# EAGLE design Button (EAGLE 9.6.2)
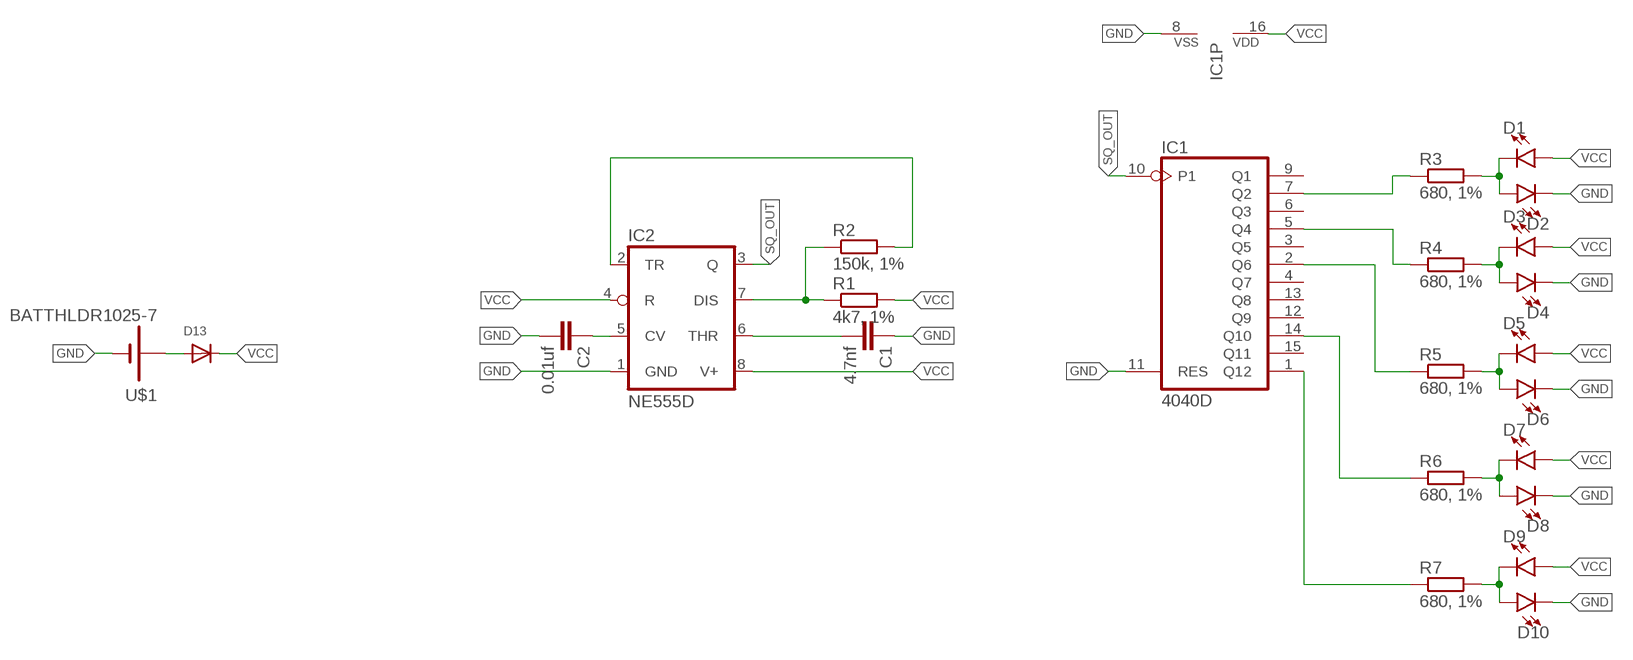
[diagram p0: schematic, sheet 1]

## Parts
C1  4.7nf  C-EUC1206  [C1206]
C2  0.01uf  C-EUC1206  [C1206]
D1  LED1206  [LED-1206]
D2  LED1206  [LED-1206]
D3  LED1206  [LED-1206]
D4  LED1206  [LED-1206]
D5  LED1206  [LED-1206]
D6  LED1206  [LED-1206]
D7  LED1206  [LED-1206]
D8  LED1206  [LED-1206]
D9  LED1206  [LED-1206]
D10  LED1206  [LED-1206]
D13  DIODESMA  [SMADIODE]
IC1  4040D  [SO16]
IC2  NE555D  [SO08]
R1  4k7, 1%  R-EU_R1206  [R1206]
R2  150k, 1%  R-EU_R1206  [R1206]
R3  680, 1%  R-EU_R1206  [R1206]
R4  680, 1%  R-EU_R1206  [R1206]
R5  680, 1%  R-EU_R1206  [R1206]
R6  680, 1%  R-EU_R1206  [R1206]
R7  680, 1%  R-EU_R1206  [R1206]
U$1  BATTHLDR1025-7  [BATTHLDR1025-7]

## Nets
+VBAT: D13.A U$1.POSITIVE(+)
GND: C1.1 C2.2 D2.C D4.C D6.C D8.C D10.C IC1.8(VSS) IC1.11(RES) IC2.1(GND) U$1.NEGATIVE(-)
N$1: C1.2 IC2.6(THR)
N$2: IC2.7(DIS) R1.1 R2.1
N$3: IC2.2(TR) R2.2
N$4: C2.1 IC2.5(CV)
N$5: D1.C D2.A R3.2
N$6: IC1.7(Q2) R3.1
N$7: D3.C D4.A R4.2
N$8: IC1.5(Q4) R4.1
N$9: D5.C D6.A R5.2
N$10: IC1.2(Q6) R5.1
N$11: D7.C D8.A R6.2
N$12: IC1.14(Q10) R6.1
N$13: D9.C D10.A R7.2
N$14: IC1.1(Q12) R7.1
SQ_OUT: IC1.10(P1) IC2.3(Q)
VCC: D1.A D3.A D5.A D7.A D9.A D13.C IC1.16(VDD) IC2.4(R) IC2.8(V+) R1.2
Unconnected: IC1.3(Q5) IC1.4(Q7) IC1.6(Q3) IC1.9(Q1) IC1.12(Q9) IC1.13(Q8) IC1.15(Q11)

## Library data of the parts
C1 C2 = rcl:C-EU: CAPACITOR, European symbol; SPICEPREFIX: C
D1-D10 = SparkFun-LED:LED: LED (Generic) Standard schematic elements and footprints for 5mm, 3mm, 1206, and 0603 sized LEDs. Generic LEDs with no color specified.
D13 = adafruit:DIODE: Diode SMADIODE - SMA Surface Mount Package 20V 1A Schottky Diode Digikey: 641-1014-6-ND DO-1N4148 - Through Hole Small Current Diode SOD-123 20V 1 A (.5mV Vf) Schottky Diode - Digikey: MBRX120TPMSCT-ND SOD-323 10V 570mA (.38mV Vf, 3ns) Schottky Diode - Digikey: ZLLS410CT-ND SOD-523 30V 30mA Schottky Diode (RB751S-40TE61) - Digikey: RB751S-40TE61CT-ND SOT23-R/W - SOT23 Package (R = Solder Paste/Reflow Ovens, W = Hand-Soldering) BAT54Film 40V 300mA - Digikey: 497-7162-1-ND
IC1 = 40xx:4040: 12-stage binary/ripple COUNTER
IC2 = linear:*555: TIMER
R1-R7 = rcl:R-EU_: RESISTOR, European symbol; SPICEPREFIX: R
U$1 = BATT_HLDR_COIN:BATTHLDR1025-7

## Net classes
0 default: width 0.305 mm, drill 0.305 mm, clearance 0.305 mm

## Board
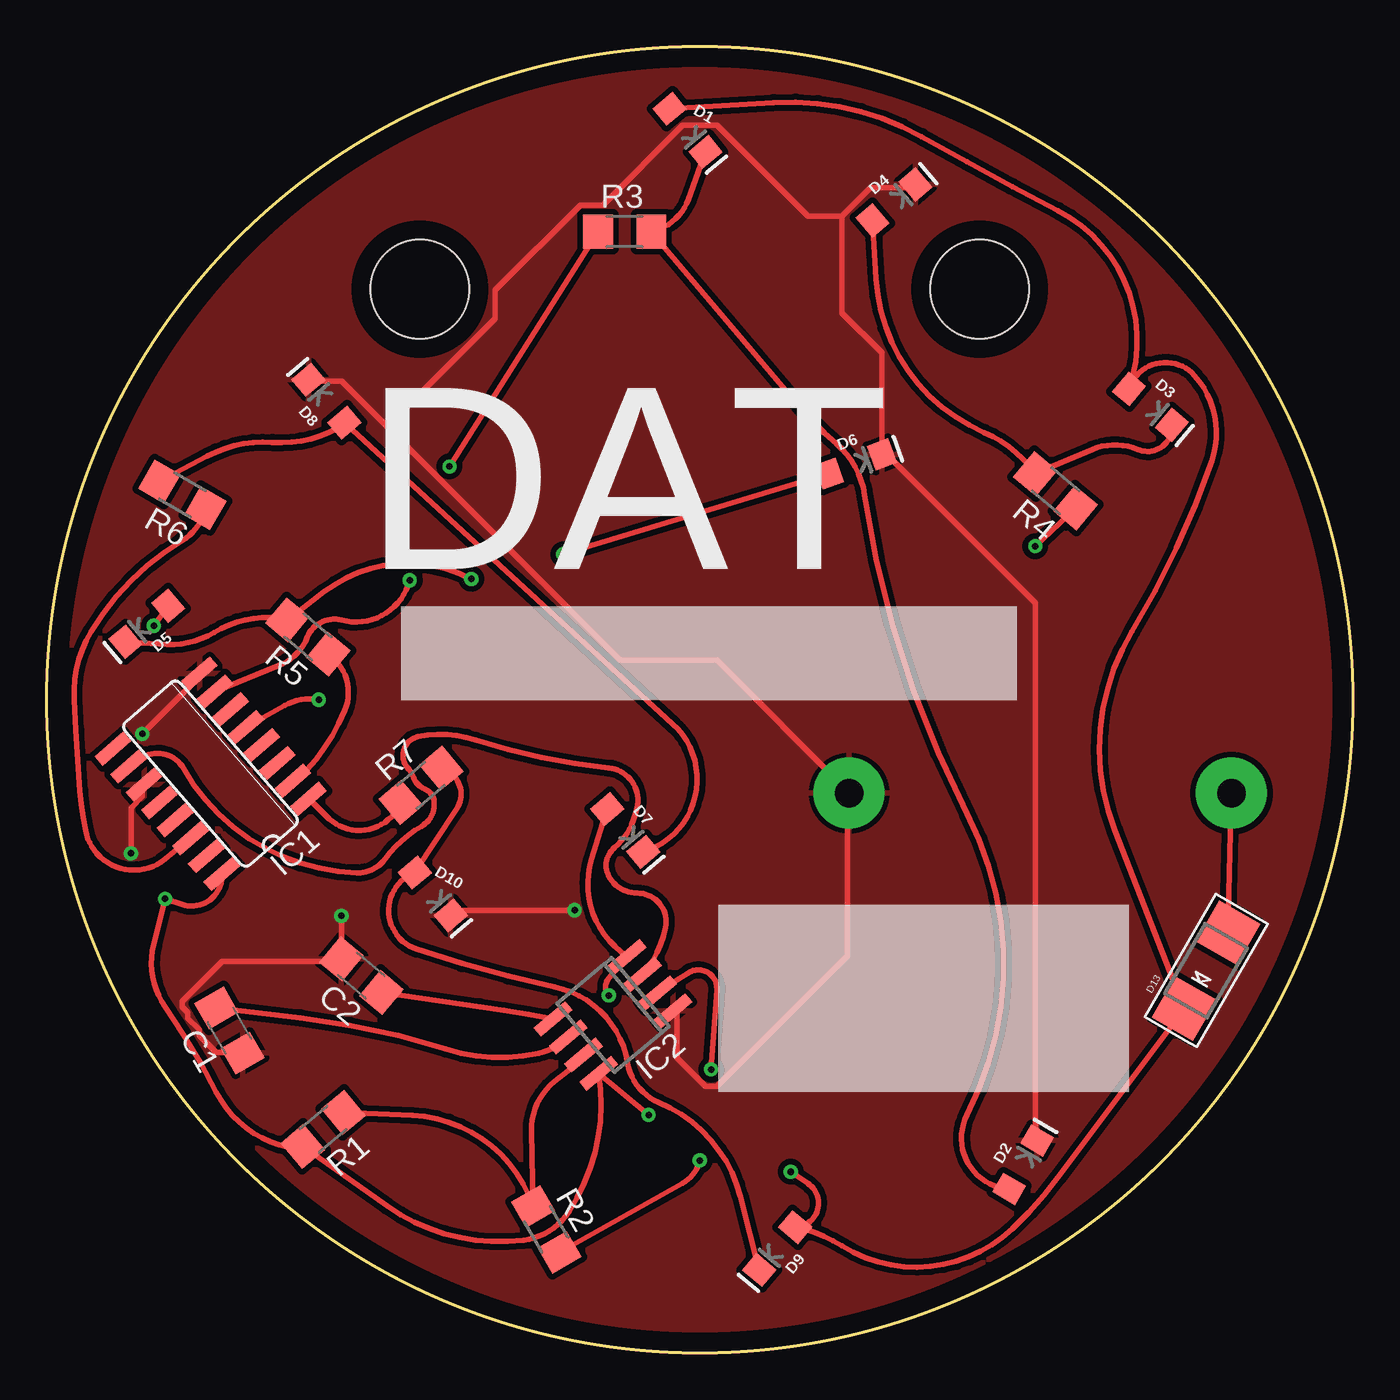
[diagram p1: board, top side]
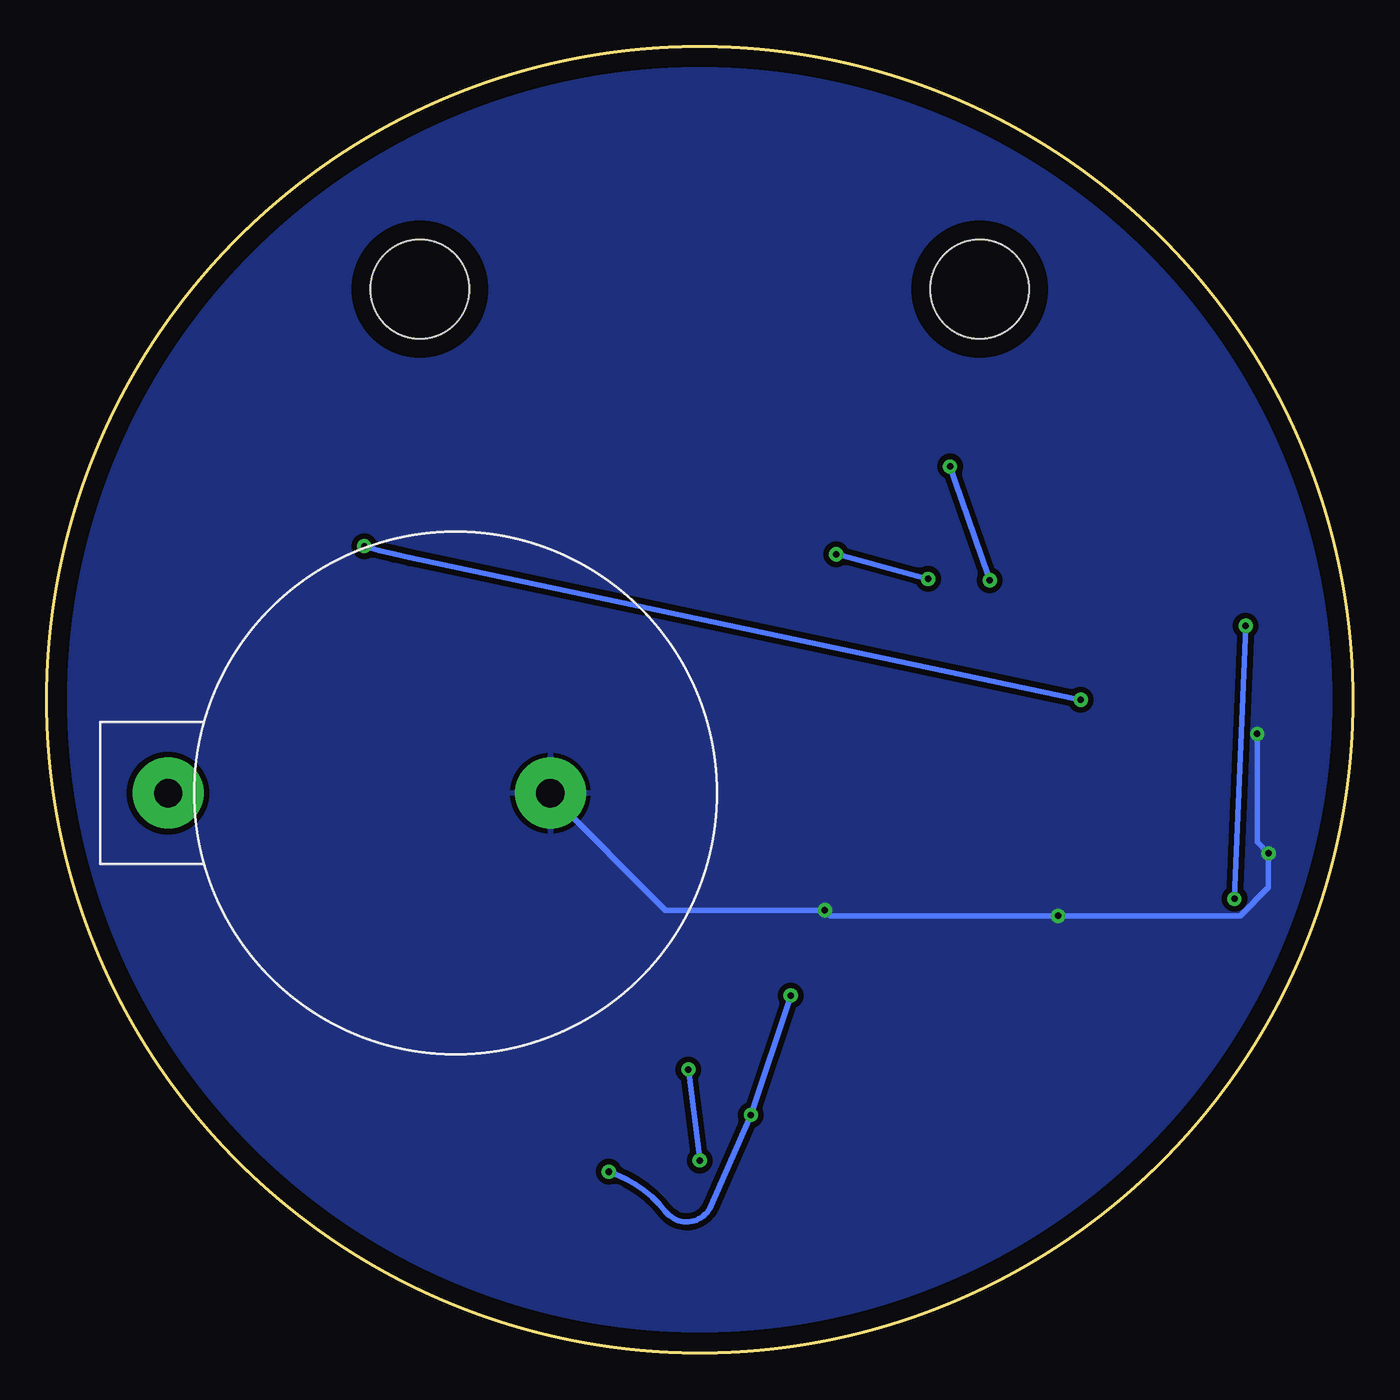
[diagram p2: board, bottom side, seen from below]

Size 70 x 70 mm. Coordinates in mm from the lower left corner, seen from the top.
Outline: circle at 35,35 radius 35
Copper layers (1*16): Top 0.035mm / dielectric 1.5mm / Bottom 0.035mm
Design rules "default": minimum track width 6mil, minimum drill 0.35mm, track to track 6mil, track to pad 6mil, pad to pad 6mil, via to via 6mil, smd to smd 6mil, copper to edge 40mil, drill to drill 6mil, minimum pad ring 10mil, minimum via ring 8mil, stop-mask expansion 4mil, vias tented up to drill 0mil, thermal gap 10mil
Holes 5.3 mm at 50,57 20,57

### Footprints (pad centres in the part's own frame; a part is rotated, then mirrored left to right if it is on the bottom)
C1206 = smd 1.6 x 1.8: 1 -1.4,0; 2 1.4,0
LED-1206 = smd 1.2 x 1.4: A -1.5,0; C 1.5,0
SMADIODE = smd 2.54 x 2.54: A 2.349,0; C -2.349,0
SO16 = smd 0.66 x 2.032: 1 -4.445,-3.073; 2 -3.175,-3.073; 3 -1.905,-3.073; 4 -0.635,-3.073; 5 0.635,-3.073; 6 1.905,-3.073; 7 3.175,-3.073; 8 4.445,-3.073; 9 4.445,3.073; 10 3.175,3.073; 11 1.905,3.073; 12 0.635,3.073; 13 -0.635,3.073; 14 -1.905,3.073; 15 -3.175,3.073; 16 -4.445,3.073
SO08 = smd 0.6 x 2.2: 1 -1.905,-2.6; 2 -0.635,-2.6; 3 0.635,-2.6; 4 1.905,-2.6; 5 1.905,2.6; 6 0.635,2.6; 7 -0.635,2.6; 8 -1.905,2.6
R1206 = smd 1.6 x 1.803: 1 -1.422,0; 2 1.422,0
BATTHLDR1025-7 = drill 1.52 pad 3.81: NEGATIVE 0,0; POSITIVE 20.49,0

### Placement (x,y rotation side)
C1  9.8,17.28 120 top
C2  16.86,20.21 140 top
D1  34.34,65.51 310 top
D2  52.33,10.09 60 top
D3  59.15,50.7 320 top
D4  45.41,61.66 40 top
D5  5.36,39.06 220 top
D6  43.35,47.64 20 top
D7  31,28 310 top
D8  15,51 130 top
D9  39.15,5.59 230 top
D10  20.69,24.59 310 top
D13  62.14,20.48 60 top
IC1  8.79,31.04 131 top
IC2  30.35,18.12 130 top
R1  14.81,11.97 220 top
R2  26.77,6.61 300 top
R3  30.98,60.09 0 top
R4  54.06,46.2 140 top
R5  14,38.37 140 top
R6  7.27,45.99 150 top
R7  20.06,30.42 40 top
U$1  43,30 180 bottom

### Tracks (layer width: path | path; a pad name or v marks a point on that pad's centre or on a via)
+VBAT
  Top 0.305: D13.A U$1.POSITIVE
GND  (via drill 0.35)
  Top 0.305: 42.62,60.91 42.62,55.73 44.75,53.59 44.75,48.41 D6.C 45.06,48.11 52.98,40.18 52.98,11.53 D2.C | 42.62,60.91 44.14,62.43 46.28,62.43 D4.C | C1.1 10.31,16.1 9.09,16.1 8.18,17.02 8.18,17.32 7.57,17.93 7.57,18.24 7.26,18.54 7.26,18.85 9.4,20.98 15.49,20.98 C2.2 15.8,21.28 v15.8,23.42 | 18.24,49.63 30.73,37.13 35.91,37.13 42.92,30.12 U$1.NEGATIVE 42.92,29.82 42.92,21.28 35.91,14.27 35.3,14.27 33.78,15.8 33.78,18.24 IC2.1 | 18.24,49.63 15.8,52.07 14.27,52.07 D8.C | v28.29,23.72 21.89,23.72 D10.C | v4.52,26.77 4.52,29.21 5.13,29.82 5.13,30.43 IC1.11 | v5.13,33.17 8.18,36.22 IC1.8 | 42.62,60.91 40.79,60.91 35.91,65.78 34.09,65.78 29.82,61.52 28.6,61.52 24.03,56.95 24.03,55.42 18.24,49.63
  Bottom 0.305: U$1.NEGATIVE 42.92,29.82 36.83,23.72 v28.29,23.72 27.99,23.42 v15.8,23.42 6.04,23.42 4.52,24.94 v4.52,26.77 5.13,27.38 v5.13,33.17
  pour Top: -19.86,79.5 77.98,79.5 77.98,-15.9 -19.86,-15.9
  pour Bottom: -26.57,85.9 83.16,85.9 83.16,-26.57 -26.57,-26.57
N$1
  Top 0.305: C1.2 13.59,17.96 arc-11 21.39,16.28 arc30 26.36,16.05 arc33 IC2.6
N$2
  Top 0.305: R1.1 19.61,12.72 arc-69 R2.1 25.98,11.89 arc-57 27.46,14.73 arc18 IC2.7
N$3  (via drill 0.35)
  Top 0.305: R2.2 34.09,9.09 arc48 v35,10.31 | v35.61,15.19 35.91,19.45 arc126 34.39,20.37 arc2 IC2.2
  Bottom 0.305: v35,10.31 v35.61,15.19
N$4
  Top 0.305: C2.1 23.21,18.54 arc-2 IC2.5
N$5
  Top 0.305: D1.C 34.39,61.82 arc-58 R3.2 40.49,50.55 arc9 42.31,48.72 arc-41 43.84,45.97 arc19 49.33,28.9 arc-54 49.33,12.75 arc114 D2.A
N$6  (via drill 0.35)
  Top 0.305: IC1.7 12.45,36.83 arc46 13.97,38.35 arc-83 15.8,39.27 arc90 v19.45,41.4 | v21.59,47.5 R3.1
  Bottom 0.305: v19.45,41.4 v21.59,47.5
N$7
  Top 0.305: D3.C arc-118 58.47,48.41 arc46 56.03,48.41 R4.2 arc32 50.24,49.33 arc-63 44.45,57.55 D4.A
N$8  (via drill 0.35)
  Top 0.305: IC1.5 12.75,34.7 arc-40 v14.58,35 | v52.98,43.23 R4.1
  Bottom 0.305: v14.58,35 50.55,42.62 arc4 v52.98,43.23
N$9  (via drill 0.35)
  Top 0.305: D5.C 6.45,37.97 arc35 8.96,38.61 arc-44 R5.2 14.88,40.79 arc-65 v22.76,41.48 | v27.68,42.8 D6.A
  Bottom 0.305: v22.76,41.48 23.35,41.64 v27.68,42.8
N$10
  Top 0.305: R5.1 arc-78 15.98,34.42 arc-24 13.4,30.69 13.36,30.73 IC1.2
N$11
  Top 0.305: D8.A 16.02,49.8 | 16.02,49.8 33.55,33.7 arc-121 D7.C | R6.2 8.61,48.06 arc-32 12.09,48.79 arc37 16.02,49.8
N$12
  Top 0.305: IC1.14 6.35,26.47 arc-88 2.69,26.77 arc-29 2.08,27.99 arc-8 1.78,30.12 arc-2 1.47,35 arc-34 2.39,38.66 arc-28 7.26,43.53 arc47 R6.1
N$13
  Top 0.305: R7.2 arc-108 21.97,29.16 D10.A arc140 19.81,21.64 arc7 27.23,19.61 arc-69 31.14,15.52 arc58 32.79,13.43 arc-53 37.18,8.36 D9.C
N$14
  Top 0.305: R7.1 arc-111 15.14,28.62 14.04,29.72 13.97,29.82 IC1.1
SQ_OUT
  Top 0.305: IC2.3 arc30 33.17,22.81 arc102 31.65,24.64 arc-63 30.12,25.55 arc-77 30.43,27.07 arc26 31.34,28.29 arc11 31.65,29.21 arc97 30.12,31.34 arc-12 22.99,32.84 arc29 19.91,33.02 arc121 19.35,31.34 arc-22 19.66,30.83 arc47 20.24,30.23 arc-65 20.78,29.46 arc-63 20.09,28.22 arc24 18.13,26.47 arc-56 16.64,25.73 arc-59 7.34,31.32 arc94 5.06,31.86 4.53,31.33 4.52,31.34 IC1.10
VCC  (via drill 0.35)
  Top 0.305: R1.2 13.95,10.9 | 13.95,10.9 18.24,7.87 arc42 25.55,6.04 arc50 27.99,7.57 arc42 IC2.8 v32.26,12.75 | D5.A v5.74,38.96 | IC1.16 arc-112 7.26,24.03 v6.35,24.33 5.74,21.89 arc49 6.35,18.54 arc-7 9.09,13.97 arc61 13.95,10.9 | D1.A 38.96,67 arc-33 46.89,65.17 arc2 54.2,61.21 arc-82 D3.A arc-119 61.52,52.37 arc-61 62.43,47.8 arc-12 58.16,38.66 arc52 57.25,27.99 D13.C 54.2,9.4 arc-10 51.76,6.65 arc-76 42.62,5.74 arc21 D9.A arc145 40.79,9.09 v39.88,9.7 | D7.A 29.21,26.47 arc75 IC2.4 30.12,20.06 arc80 v30.12,19.15
  Bottom 0.305: v5.74,38.96 v6.35,24.33 | v30.12,19.15 v32.26,12.75 34.39,7.87 arc118 36.83,7.57 arc-34 v39.88,9.7

### Text on the board
tPlace: DAT